# EAGLE schematic PWM2DC (EAGLE 7.4.0)
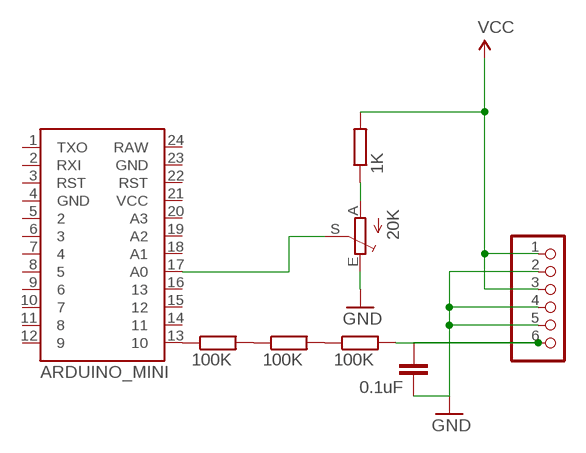
[diagram p0: schematic, sheet 1]

## Parts
C1  0.1uF  C-EU050-025X075  [C050-025X075]
JP1  PINHD-1X6  [1X06]
R1  100K  R-EU_0207/10  [0207/10]
R2  100K  R-EU_0207/10  [0207/10]
R3  100K  R-EU_0207/10  [0207/10]
R4  20K  TRIM_EU-RJ9W  [RJ9W]
R5  1K  R-EU_0207/10  [0207/10]
U$1  ARDUINO_MINI  [ARDUINO_MINI]

## Nets
GND: C1.1 JP1.2 JP1.4 JP1.5 R4.E
N$1: C1.2 JP1.6 R3.2
N$2: R1.1 U$1.13
N$3: R1.2 R2.1
N$4: R2.2 R3.1
N$6: R4.A R5.1
N$7: R4.S U$1.17(A0)
VCC: JP1.1 JP1.3 R5.2
Unconnected: U$1.1(TXO) U$1.2(RXI) U$1.3(RST) U$1.4(GND) U$1.5 U$1.6 U$1.7 U$1.8 U$1.9 U$1.10 U$1.11 U$1.12 U$1.14 U$1.15 U$1.16 U$1.18(A1) U$1.19(A2) U$1.20(A3) U$1.21(VCC) U$1.22(RST) U$1.23(GND) U$1.24(RAW)

## Library data of the parts
C1 = rcl:C-EU: CAPACITOR, European symbol
JP1 = pinhead:PINHD-1X6: PIN HEADER
R1-R3 R5 = rcl:R-EU_: RESISTOR, European symbol
R4 = pot:TRIM_EU-: POTENTIOMETER
U$1 = SparkFun-Boards:ARDUINO_MINI: Arduino Pro Mini footprint